# EAGLE design tweeq-BATT_SR621 (EAGLE 7.2.0)
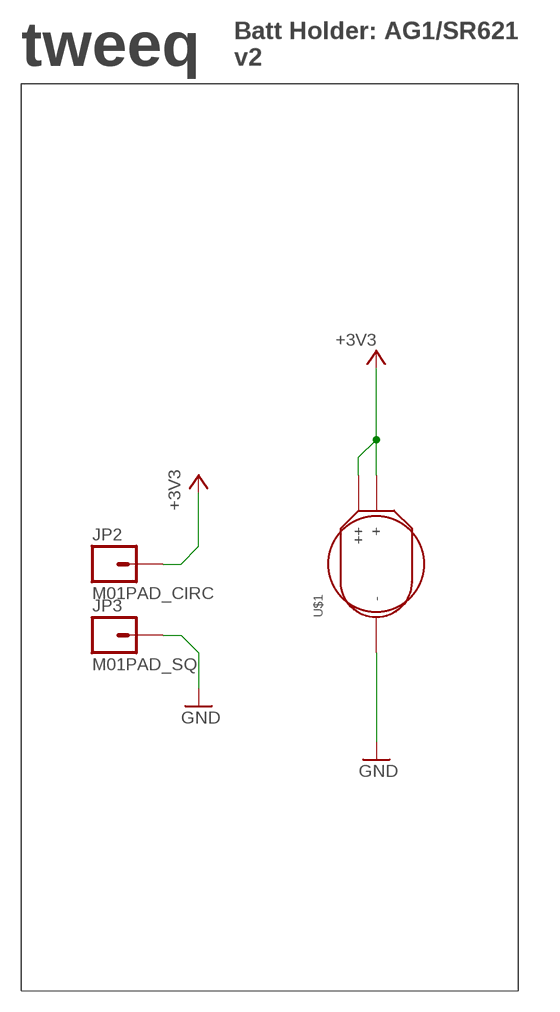
[diagram p0: schematic, sheet 1]

## Parts
JP2  M01PAD_CIRC  [1X01_PAD_CIRC]
JP3  M01PAD_SQ  [1X01_PAD_SQ]
U$1  BATT_COMMON/AG1  [BATT_AG1_TH]

## Nets
+3V3: JP2.1 U$1.+1(+) U$1.+2(++)
GND: JP3.1 U$1.-

## Notes on the sheet
- tweeq
- Batt Holder: AG1/SR621
  v2

## Library data of the parts
JP2 JP3 = AISCube:M01: Header 1 Standard 1-pin 0.1" header.
U$1 = AISCube:BATT_COMMON

## Board
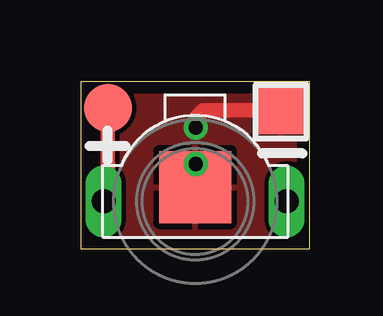
[diagram p1: board, top side]
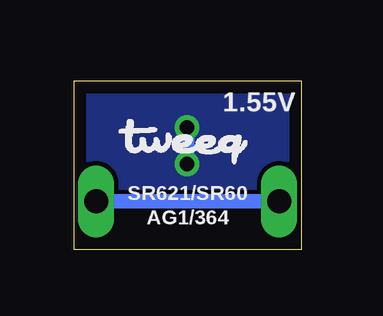
[diagram p2: board, bottom side, seen from below]

Size 9.5 x 7 mm. Coordinates in mm from the lower left corner, seen from the top.
Outline: 0,7 9.5,7 9.5,0 0,0 0,7
Copper layers (1*16): Top 0.0356mm / dielectric 1.5011mm / Bottom 0.0356mm
Design rules "AISCube": minimum track width 7mil, minimum drill 14mil, track to track 7mil, track to pad 7mil, pad to pad 7mil, via to via 7mil, smd to smd 0mil, copper to edge 20mil, drill to drill 8mil, minimum pad ring 10mil, minimum via ring 8mil, stop-mask expansion 4mil, vias tented up to drill 32mil, thermal gap 10mil

### Footprints (pad centres in the part's own frame; a part is rotated, then mirrored left to right if it is on the bottom)
1X01_PAD_CIRC = smd 2 x 2: 1 0,0
1X01_PAD_SQ = smd 2 x 2: 1 0,0
BATT_AG1_TH = drill 1 long: +1 -3.81,0; +2 3.81,0 | smd 3 x 3: - 0,0.6

### Placement (x,y rotation side)
JP2  1.12,5.89 0 top
JP3  8.33,5.79 0 top
U$1  4.75,2 0 top
U$2  [TWEEQ-LOGO-S]  7.62,3.56 0 bottom

### Tracks (layer width: path | path; a pad name or v marks a point on that pad's centre or on a via)
+3V3
  Top 0.61: JP2.1 1.12,2.18 U$1.+1
  Bottom 0.61: U$1.+2 U$1.+1
GND  (via drill 0.6)
  Top 0.61: JP3.1 5.08,5.79 4.78,5.49 v4.78,5.08 | v4.78,3.56 4.78,2.62 U$1.-
  Bottom 0.61: v4.78,5.08 v4.78,3.56
  pour Top: 9.3,6.8 9.3,0.18 0.15,0.18 0.15,6.8
  pour Bottom: 9.3,0.18 9.3,6.8 0.15,6.8 0.15,0.18

### Text on the board
bPlace: 1.55V | SR621/SR60 | AG1/364
tNames: 6V-9V DC | ON
bNames: Breadboard | V-Reg | Module